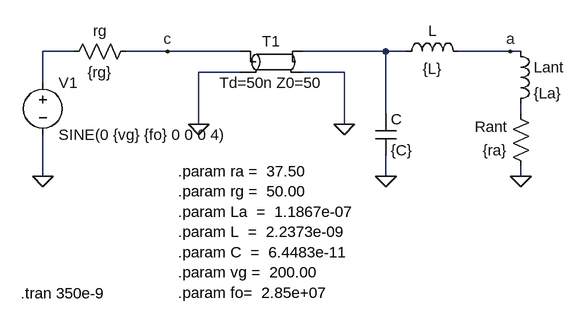
[diagram p0: schematic Entrega_clase_1_a.asc]
Entrega_clase_1_a.asc, the LTspice schematic file:
Version 4
SHEET 1 880 680
WIRE -256 80 -304 80
WIRE -112 80 -176 80
WIRE 0 80 -112 80
WIRE 224 80 96 80
WIRE 256 80 224 80
WIRE 416 80 336 80
WIRE 432 80 416 80
WIRE 0 112 -64 112
WIRE 160 112 96 112
WIRE -304 128 -304 80
WIRE 224 176 224 80
WIRE 432 176 432 160
WIRE -64 192 -64 112
WIRE 160 192 160 112
WIRE -304 272 -304 208
WIRE 224 272 224 240
WIRE 432 272 432 256
FLAG -304 272 0
FLAG 224 272 0
FLAG 432 272 0
FLAG 160 192 0
FLAG -64 192 0
FLAG -112 80 c
FLAG 416 80 a
SYMBOL voltage -304 112 R0
WINDOW 123 0 0 Left 0
WINDOW 39 0 0 Left 0
SYMATTR InstName V1
SYMATTR Value SINE(0 {vg} {fo} 0 0 0 4)
SYMBOL res -272 96 R270
WINDOW 0 32 56 VTop 2
WINDOW 3 0 56 VBottom 2
SYMATTR InstName rg
SYMATTR Value {rg}
SYMBOL res 448 272 R180
WINDOW 0 36 76 Left 2
WINDOW 3 36 40 Left 2
SYMATTR InstName Rant
SYMATTR Value {ra}
SYMBOL ind 416 64 R0
SYMATTR InstName Lant
SYMATTR Value {La}
SYMBOL cap 208 176 R0
SYMATTR InstName C
SYMATTR Value {C}
SYMBOL ind 240 96 R270
WINDOW 0 32 56 VTop 2
WINDOW 3 5 56 VBottom 2
SYMATTR InstName L
SYMATTR Value {L}
SYMBOL tline 48 96 R0
SYMATTR InstName T1
TEXT -338 452 Left 2 !.tran 350e-9
TEXT -96 264 Left 2 !.param ra =  37.50 \n.param rg =  50.00 \n.param La  =  1.1867e-07 \n.param L  =  2.2373e-09 \n.param C  =  6.4483e-11 \n.param vg =  200.00 \n.param fo=  2.85e+07

The netlist it stands for:
* Entrega_clase_1_a.asc
V1 N001 0 SINE(0 {vg} {fo} 0 0 0 4)
rg N001 c {rg}
Rant 0 N003 {ra}
Lant a N003 {La}
C N002 0 {C}
L N002 a {L}
T1 c 0 N002 0 Td=50n Z0=50
.tran 350e-9
.param ra =  37.50
.param rg =  50.00
.param La  =  1.1867e-07
.param L  =  2.2373e-09
.param C  =  6.4483e-11
.param vg =  200.00
.param fo=  2.85e+07
.backanno
.end